# Altium schematic sheet TM4C1294NCPDT_simple.SchDoc
size A4
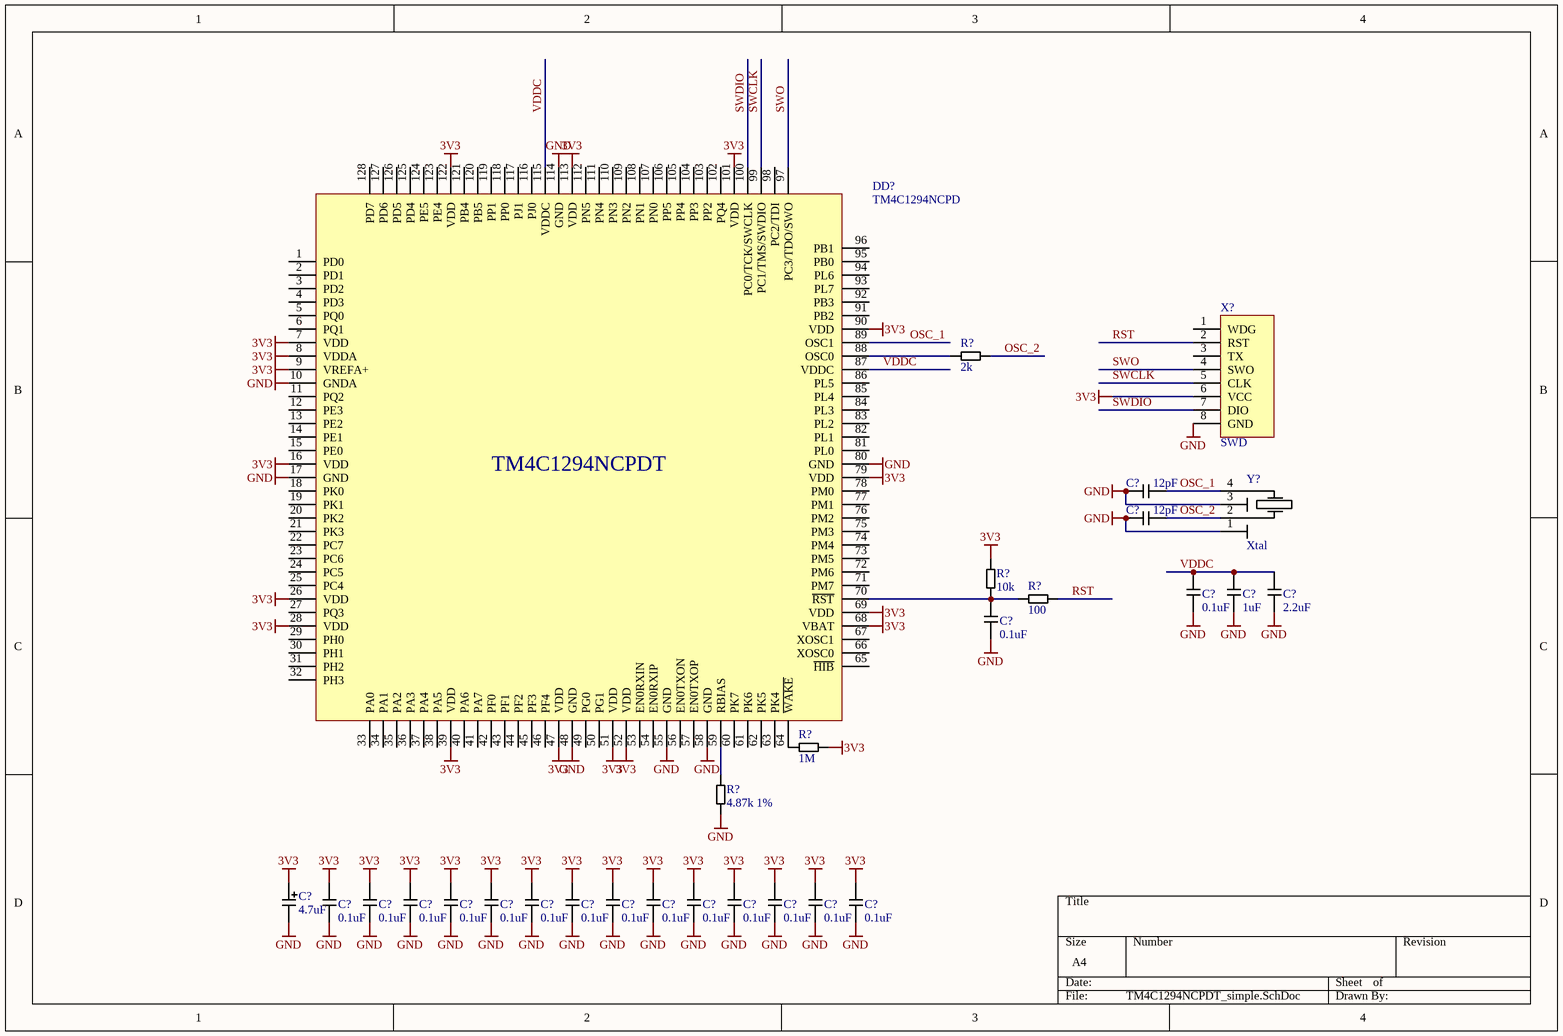
[diagram p0: TM4C1294NCPDT_simple.SchDoc]

## Parts
(Parts that share a designator on the sheet are numbered #1, #2 ... from top to bottom, then left to right.)
C?#1  12pF  [C0603]
C?#2  12pF  [C0603]
C?#3  0.1uF  [C0603]
C?#4  1uF  [C0603]
C?#5  2.2uF  [C0603]
C?#6  0.1uF  [C0603]
C?#7  4.7uF  [SMD A]
C?#8  0.1uF  [C0603]
C?#9  0.1uF  [C0603]
C?#10  0.1uF  [C0603]
C?#11  0.1uF  [C0603]
C?#12  0.1uF  [C0603]
C?#13  0.1uF  [C0603]
C?#14  0.1uF  [C0603]
C?#15  0.1uF  [C0603]
C?#16  0.1uF  [C0603]
C?#17  0.1uF  [C0603]
C?#18  0.1uF  [C0603]
C?#19  0.1uF  [C0603]
C?#20  0.1uF  [C0603]
C?#21  0.1uF  [C0603]
DD?  TM4C1294NCPD  [TQFP-128]
R?#1  2k  [R0603]
R?#2  10k  [R0603]
R?#3  100  [R0603]
R?#4  1M  [R0603]
R?#5  4.87k 1%  [R0603]
X?  SWD  [PogoSWD]
Y?  Xtal  [Xtal 0532]

## Nets
3V3: C?#7.1 C?#8.1 C?#9.1 C?#10.1 C?#11.1 C?#12.1 C?#13.1 C?#14.1 C?#15.1 C?#16.1 C?#17.1 C?#18.1 C?#19.1 C?#20.1 C?#21.1 DD?.7(VDD) DD?.8(VDDA) DD?.9(VREFA+) DD?.16(VDD) DD?.26(VDD) DD?.28(VDD) DD?.39(VDD) DD?.47(VDD) DD?.51(VDD) DD?.52(VDD) DD?.68(VBAT) DD?.69(VDD) DD?.79(VDD) DD?.90(VDD) DD?.101(VDD) DD?.113(VDD) DD?.122(VDD) R?#2.2 R?#4.2 X?.6(VCC)
GND: C?#1.1 C?#2.1 C?#3.2 C?#4.2 C?#5.2 C?#6.2 C?#7.2 C?#8.2 C?#9.2 C?#10.2 C?#11.2 C?#12.2 C?#13.2 C?#14.2 C?#15.2 C?#16.2 C?#17.2 C?#18.2 C?#19.2 C?#20.2 C?#21.2 DD?.10(GNDA) DD?.17(GND) DD?.48(GND) DD?.55(GND) DD?.58(GND) DD?.80(GND) DD?.114(GND) R?#5.1 X?.8(GND) Y?.1(X1) Y?.3(X2)
OSC_1: C?#1.2 DD?.89(OSC1) Y?.4(GND)
OSC_2: C?#2.2 R?#1.2 Y?.2(GND)
RST: R?#3.2 X?.2(RST)
SWCLK: DD?.99(PC1/TMS/SWDIO) X?.5(CLK)
SWDIO: DD?.100(PC0/TCK/SWCLK) X?.7(DIO)
SWO: DD?.97(PC3/TDO/SWO) X?.4(SWO)
VDDC: C?#3.1 C?#4.1 C?#5.1 DD?.87(VDDC) DD?.115(VDDC)
NetC?#6_1: C?#6.1 DD?.70(~{RST}) R?#2.1 R?#3.1
NetDD?_59: DD?.59(RBIAS) R?#5.2
NetDD?_64: DD?.64(~{WAKE}) R?#4.1
NetDD?_88: DD?.88(OSC0) R?#1.1

Not connected (* = marked no-connect by the designer): DD? 1(PD0) 2(PD1) 3(PD2) 4(PD3) 5(PQ0) 6(PQ1) 11(PQ2) 12(PE3) 13(PE2) 14(PE1) 15(PE0) 18(PK0) 19(PK1) 20(PK2) 21(PK3) 22(PC7) 23(PC6) 24(PC5) 25(PC4) 27(PQ3) 29(PH0) 30(PH1) 31(PH2) 32(PH3) 33(PA0) 34(PA1) 35(PA2) 36(PA3) 37(PA4) 38(PA5) 40(PA6) 41(PA7) 42(PF0) 43(PF1) 44(PF2) 45(PF3) 46(PF4) 49(PG0) 50(PG1) 53(EN0RXIN) 54(EN0RXIP) 56(EN0TXON) 57(EN0TXOP) 60(PK7) 61(PK6) 62(PK5) 63(PK4) 65(~{HIB}) 66(XOSC0) 67(XOSC1) 71(PM7) 72(PM6) 73(PM5) 74(PM4) 75(PM3) 76(PM2) 77(PM1) 78(PM0) 81(PL0) 82(PL1) 83(PL2) 84(PL3) 85(PL4) 86(PL5) 91(PB2) 92(PB3) 93(PL7) 94(PL6) 95(PB0) 96(PB1) 98(PC2/TDI) 102(PQ4) 103(PP2) 104(PP3) 105(PP4) 106(PP5) 107(PN0) 108(PN1) 109(PN2) 110(PN3) 111(PN4) 112(PN5) 116(PJ0) 117(PJ1) 118(PP0) 119(PP1) 120(PB5) 121(PB4) 123(PE4) 124(PE5) 125(PD4) 126(PD5) 127(PD6) 128(PD7); X? 1(WDG) 3(TX)

## Notes on the sheet
- (in symbol TM4C1294NCPD) TM4C1294NCPDT

## Library data of the parts
C?#1-C?#6 C?#8-C?#21 = C: Capacitor
C?#7 = CP: Capacitor polarized
DD? = TM4C1294NCPD: TI Cortex-M4F MCU Tiva-C
R?#1-R?#5 = R: Resistor
X? = SWD-Pogo: SWD connector for PogoPins
Y? = Xtal: Quartz crystal